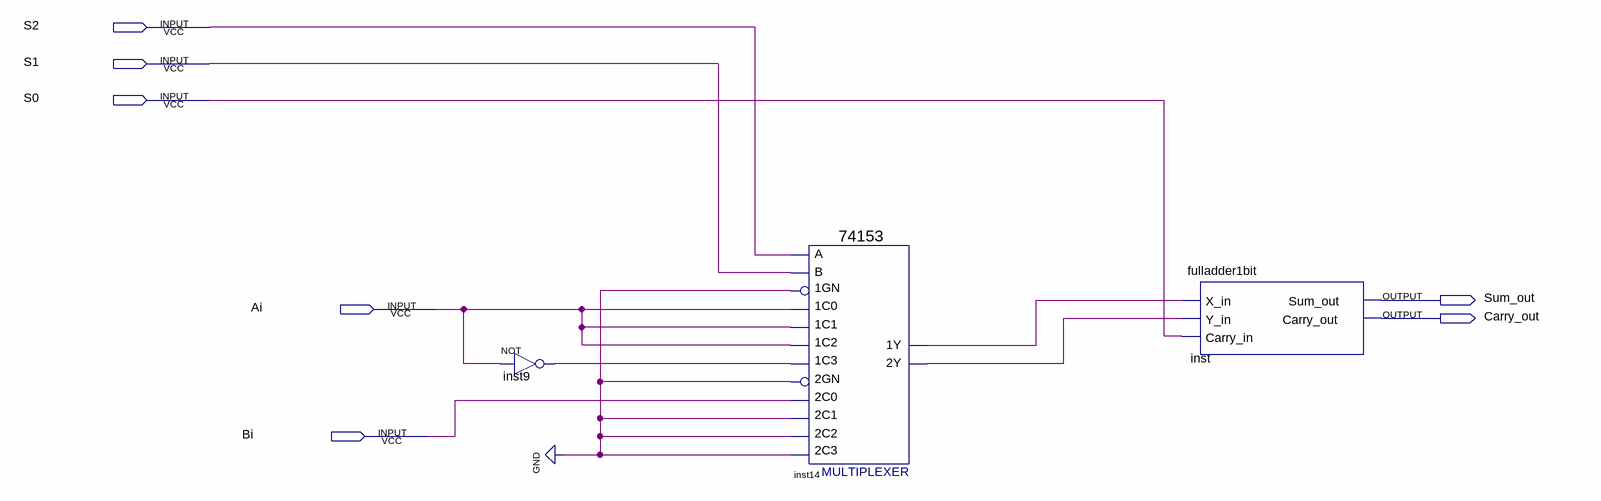
[diagram p0: schematic sheet]
// Quartus schematic arithcircuit1bit.bdf as structural Verilog: 3 symbols, 7 pins
module arithcircuit1bit (
  input  S2,
  input  S1,
  input  S0,
  input  Ai,
  input  Bi,
  output Sum_out,
  output Carry_out
);

  wire inst9_out, inst14_1y, inst14_2y;

  not inst9 (inst9_out, Ai);
  \74153  inst14 (
    .\1C1 (Ai), .\1GN (1'b0), .\1C0 (Ai), .\2C0 (Bi), .\2GN (1'b0), .\2C2 (1'b0), .\1C2 (Ai),
    .\1C3 (inst9_out), .B(S1), .A(S2), .\2C1 (1'b0), .\2C3 (1'b0), .\1Y (inst14_1y), .\2Y (inst14_2y));
  fulladder1bit inst (.X_in(inst14_1y), .Y_in(inst14_2y), .Carry_in(S0), .Sum_out(Sum_out), .Carry_out(Carry_out));
endmodule
